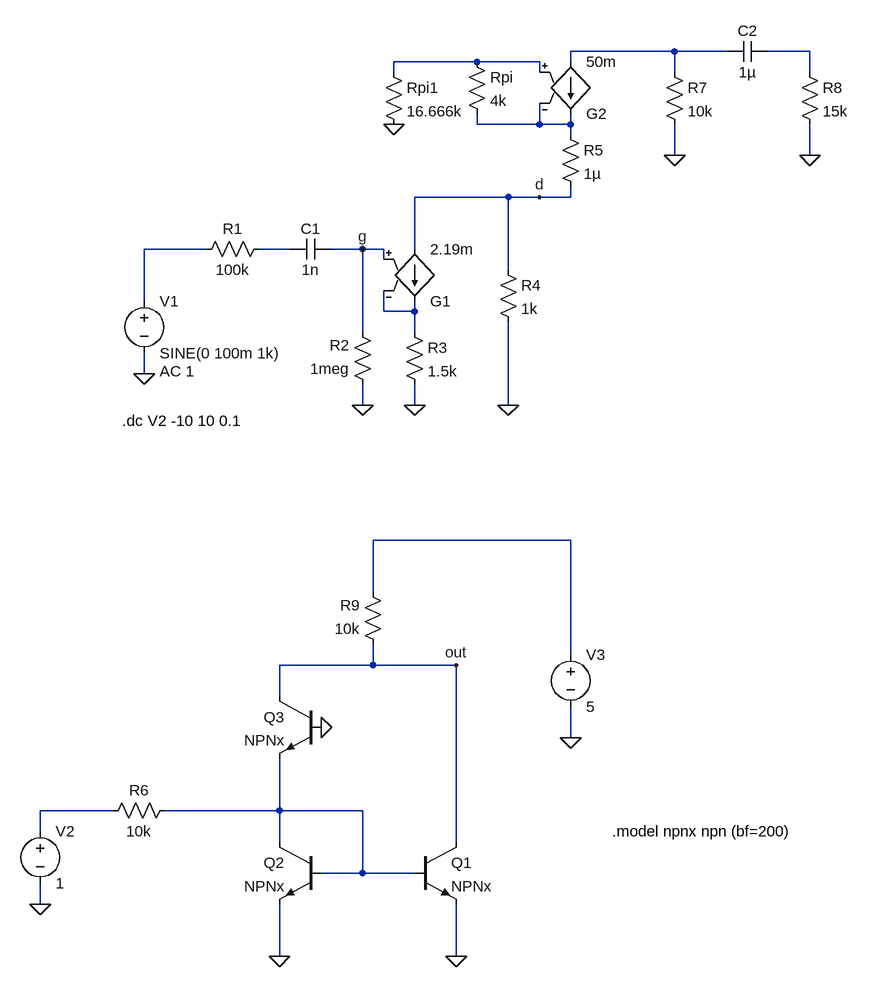
[diagram p0: schematic 2012_ampl_ers.asc]
2012_ampl_ers.asc, the LTspice schematic file:
Version 4
SHEET 1 880 1508
WIRE 0 96 -160 96
WIRE 80 96 0 96
WIRE 208 96 144 96
WIRE -304 112 -432 112
WIRE -208 112 -304 112
WIRE -160 112 -160 96
WIRE -432 128 -432 112
WIRE -208 128 -208 112
WIRE 0 128 0 96
WIRE 208 128 208 96
WIRE -304 208 -304 192
WIRE -208 208 -208 176
WIRE -208 208 -304 208
WIRE -160 208 -160 192
WIRE -160 208 -208 208
WIRE -160 224 -160 208
WIRE 0 256 0 208
WIRE 208 256 208 208
WIRE -256 320 -400 320
WIRE -208 320 -256 320
WIRE -160 320 -160 304
WIRE -160 320 -208 320
WIRE -720 400 -816 400
WIRE -592 400 -640 400
WIRE -480 400 -528 400
WIRE -448 400 -480 400
WIRE -400 400 -400 320
WIRE -448 416 -448 400
WIRE -256 432 -256 320
WIRE -816 480 -816 400
WIRE -448 496 -448 464
WIRE -400 496 -400 480
WIRE -400 496 -448 496
WIRE -480 528 -480 400
WIRE -400 528 -400 496
WIRE -816 592 -816 560
WIRE -480 640 -480 608
WIRE -400 640 -400 608
WIRE -256 640 -256 512
WIRE -160 848 -464 848
WIRE -464 928 -464 848
WIRE -160 1024 -160 848
WIRE -464 1040 -464 1008
WIRE -464 1040 -608 1040
WIRE -336 1040 -464 1040
WIRE -608 1088 -608 1040
WIRE -160 1152 -160 1104
WIRE -864 1264 -976 1264
WIRE -608 1264 -608 1184
WIRE -608 1264 -784 1264
WIRE -480 1264 -608 1264
WIRE -976 1296 -976 1264
WIRE -608 1312 -608 1264
WIRE -336 1312 -336 1040
WIRE -480 1360 -480 1264
WIRE -480 1360 -544 1360
WIRE -400 1360 -480 1360
WIRE -976 1408 -976 1376
WIRE -608 1488 -608 1408
WIRE -336 1488 -336 1408
FLAG -816 592 0
FLAG -432 208 0
FLAG -256 640 0
FLAG -400 640 0
FLAG -480 640 0
FLAG 208 256 0
FLAG 0 256 0
FLAG -480 400 g
FLAG -208 320 d
FLAG -160 1152 0
FLAG -608 1488 0
FLAG -336 1488 0
FLAG -544 1136 0
FLAG -976 1408 0
FLAG -336 1040 out
SYMBOL voltage -816 464 R0
WINDOW 123 24 124 Left 2
WINDOW 39 0 0 Left 2
SYMATTR InstName V1
SYMATTR Value SINE(0 100m 1k)
SYMATTR Value2 AC 1
SYMBOL res -624 384 R90
WINDOW 0 0 56 VBottom 2
WINDOW 3 32 56 VTop 2
SYMATTR InstName R1
SYMATTR Value 100k
SYMBOL res -464 624 R180
WINDOW 0 36 76 Left 2
WINDOW 3 36 40 Left 2
SYMATTR InstName R2
SYMATTR Value 1meg
SYMBOL cap -528 384 R90
WINDOW 0 0 32 VBottom 2
WINDOW 3 32 32 VTop 2
SYMATTR InstName C1
SYMATTR Value 1n
SYMBOL res -416 512 R0
SYMATTR InstName R3
SYMATTR Value 1.5k
SYMBOL res -272 416 R0
SYMATTR InstName R4
SYMATTR Value 1k
SYMBOL res -320 96 R0
SYMATTR InstName Rpi
SYMATTR Value 4k
SYMBOL res -16 112 R0
SYMATTR InstName R7
SYMATTR Value 10k
SYMBOL res 192 112 R0
SYMATTR InstName R8
SYMATTR Value 15k
SYMBOL cap 144 80 R90
WINDOW 0 0 32 VBottom 2
WINDOW 3 32 32 VTop 2
SYMATTR InstName C2
SYMATTR Value 1µ
SYMBOL g2 -400 496 M180
SYMATTR InstName G1
SYMATTR Value 2.19m
SYMBOL g2 -160 208 M180
SYMATTR InstName G2
SYMATTR Value 50m
SYMBOL res -448 112 R0
SYMATTR InstName Rpi1
SYMATTR Value 16.666k
SYMBOL res -176 208 R0
SYMATTR InstName R5
SYMATTR Value 1µ
SYMBOL npn -400 1312 R0
SYMATTR InstName Q1
SYMATTR Value NPNx
SYMBOL npn -544 1312 M0
SYMATTR InstName Q2
SYMATTR Value NPNx
SYMBOL npn -544 1088 M0
SYMATTR InstName Q3
SYMATTR Value NPNx
SYMBOL voltage -976 1280 R0
WINDOW 123 0 0 Left 2
WINDOW 39 0 0 Left 2
SYMATTR InstName V2
SYMATTR Value 1
SYMBOL res -768 1248 R90
WINDOW 0 0 56 VBottom 2
WINDOW 3 32 56 VTop 2
SYMATTR InstName R6
SYMATTR Value 10k
SYMBOL res -448 1024 R180
WINDOW 0 36 76 Left 2
WINDOW 3 36 40 Left 2
SYMATTR InstName R9
SYMATTR Value 10k
SYMBOL voltage -160 1008 R0
WINDOW 123 0 0 Left 2
WINDOW 39 0 0 Left 2
SYMATTR InstName V3
SYMATTR Value 5
TEXT -850 664 Left 2 !.dc V2 -10 10 0.1
TEXT -96 1296 Left 2 !.model npnx npn (bf=200)

The netlist it stands for:
* 2012_ampl_ers.asc
V1 N005 0 SINE(0 100m 1k) AC 1
R1 N006 N005 100k
R2 0 g 1meg
C1 g N006 1n
R3 N007 0 1.5k
R4 d 0 1k
Rpi N003 N004 4k
R7 N001 0 10k
R8 N002 0 15k
C2 N002 N001 1µ
G1 d N007 g N007 2.19m
G2 N001 N004 N003 N004 50m
Rpi1 N003 0 16.666k
R5 N004 d 1µ
Q1 out N010 0 0 NPNx
Q2 N010 N010 0 0 NPNx
Q3 out 0 N010 0 NPNx
V2 N009 0 1
R6 N010 N009 10k
R9 out N008 10k
V3 N008 0 5
.model NPN NPN
.model PNP PNP
.lib standard.bjt
.dc V2 -10 10 0.1
.model npnx npn (bf=200)
.backanno
.end